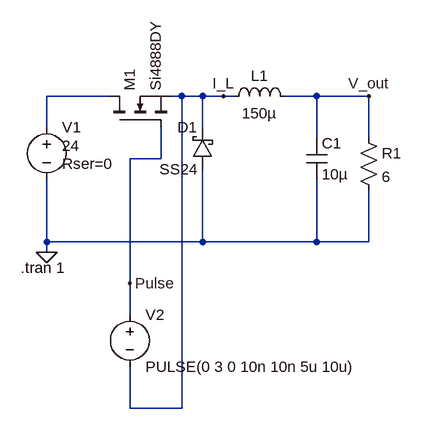
[diagram p0: schematic Open_Loop_Buck.asc]
Open_Loop_Buck.asc, the LTspice schematic file:
Version 4.1
SHEET 1 880 680
WIRE 256 -160 160 -160
WIRE 368 -160 352 -160
WIRE 400 -160 368 -160
WIRE 432 -160 400 -160
WIRE 448 -160 432 -160
WIRE 576 -160 528 -160
WIRE 656 -160 576 -160
WIRE 160 -112 160 -160
WIRE 400 -112 400 -160
WIRE 576 -96 576 -160
WIRE 656 -96 656 -160
WIRE 336 -64 336 -112
WIRE 336 -64 288 -64
WIRE 160 64 160 -32
WIRE 400 64 400 -48
WIRE 400 64 160 64
WIRE 576 64 576 -32
WIRE 576 64 400 64
WIRE 656 64 656 -16
WIRE 656 64 576 64
WIRE 160 80 160 64
WIRE 288 128 288 -64
WIRE 288 176 288 128
WIRE 288 320 288 256
WIRE 368 320 368 -160
WIRE 368 320 288 320
FLAG 160 80 0
FLAG 656 -160 V_out
FLAG 432 -160 I_L
FLAG 288 128 Pulse
SYMBOL voltage 160 -128 R0
WINDOW 3 24 44 Left 2
WINDOW 123 0 0 Left 0
WINDOW 39 24 72 Left 2
SYMATTR InstName V1
SYMATTR Value 24
SYMATTR SpiceLine Rser=0
SYMBOL nmos 256 -112 R270
SYMATTR InstName M1
SYMATTR Value Si4888DY
SYMBOL schottky 416 -48 R180
WINDOW 0 24 64 Left 2
WINDOW 3 24 0 Left 2
SYMATTR InstName D1
SYMATTR Value SS24
SYMATTR Description Diode
SYMATTR Type diode
SYMBOL res 640 -112 R0
SYMATTR InstName R1
SYMATTR Value 6
SYMBOL cap 560 -96 R0
SYMATTR InstName C1
SYMATTR Value 10µ
SYMATTR SpiceLine V=30V Irms=0 Rser=0 Lser=0
SYMBOL ind 432 -144 R270
WINDOW 0 32 56 VTop 2
WINDOW 3 5 56 VBottom 2
SYMATTR InstName L1
SYMATTR Value 150µ
SYMATTR SpiceLine Ipk=3 Rser=0 Rpar=10e9 Cpar=0
SYMBOL voltage 288 160 R0
WINDOW 123 0 0 Left 0
WINDOW 39 0 0 Left 0
SYMATTR InstName V2
SYMATTR Value PULSE(0 3 0 10n 10n 5u 10u)
TEXT 120 104 Left 2 !.tran 1

The netlist it stands for:
* Open_Loop_Buck.asc
V1 N001 0 24 Rser=0
M1 N001 Pulse I_L I_L Si4888DY
D1 0 I_L SS24
R1 V_out 0 6
C1 V_out 0 10µ V=30V Irms=0 Rser=0 Lser=0
L1 I_L V_out 150µ Ipk=3 Rser=0 Rpar=10e9 Cpar=0
V2 Pulse I_L PULSE(0 3 0 10n 10n 5u 10u)
.model D D
.lib standard.dio
.model NMOS NMOS
.model PMOS PMOS
.lib standard.mos
.tran 1
.backanno
.end